# EAGLE design MC70_FSK_Modboard (EAGLE 6.4)
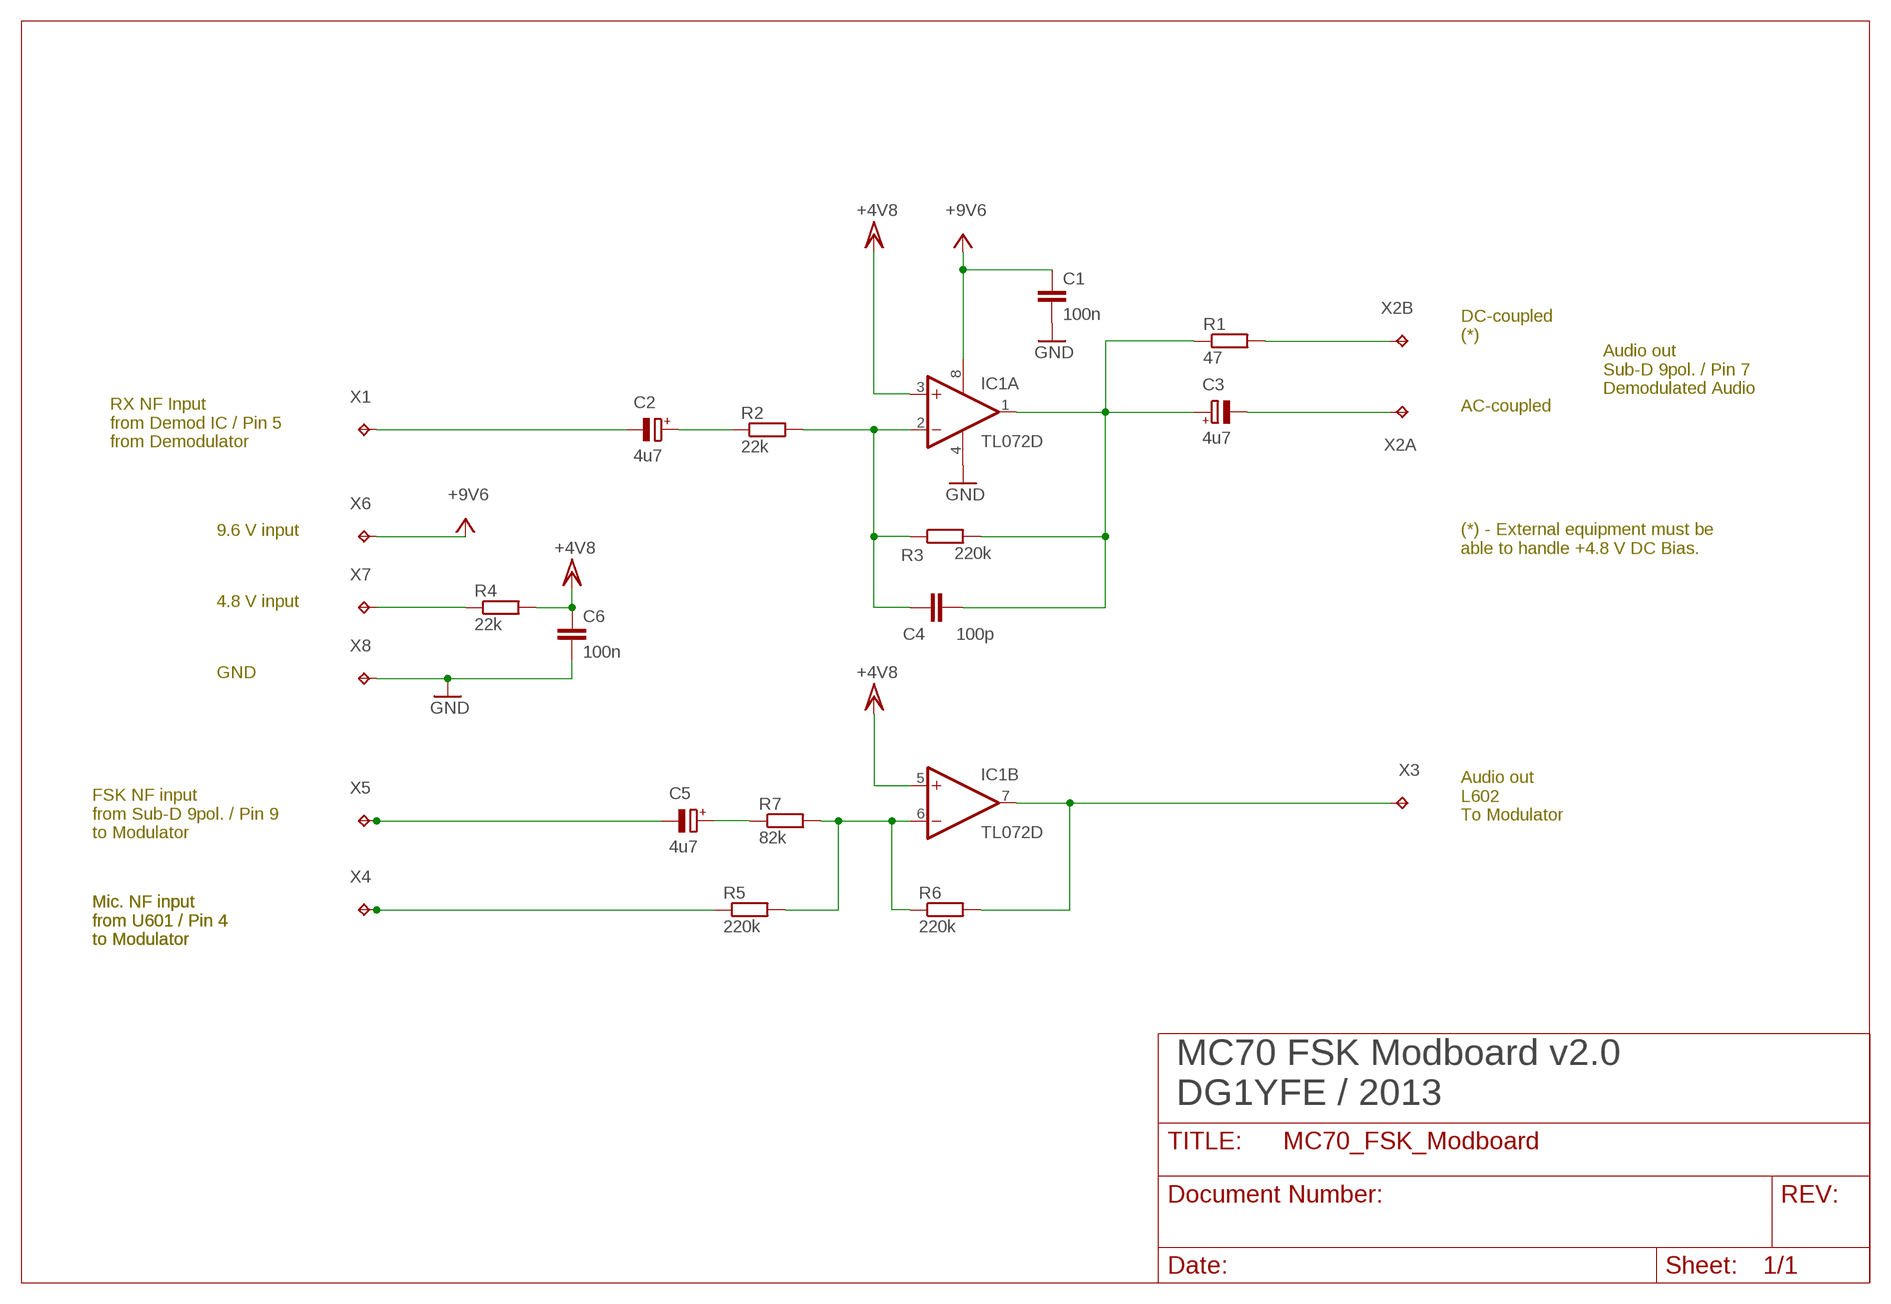
[diagram p0: schematic, sheet 1]

## Parts
C1  100n  C-EUC0805  [C0805]
C2  4u7  CPOL-EUA/3216-18R  [A/3216-18R]
C3  4u7  CPOL-EUA/3216-18R  [A/3216-18R]
C4  100p  C-EUC0805  [C0805]
C5  4u7  CPOL-EUA/3216-18R  [A/3216-18R]
C6  100n  C-EUC0805  [C0805]
IC1  TL072D  [SO08]
R1  47  R-EU_R0805  [R0805]
R2  22k  R-EU_R0805  [R0805]
R3  220k  R-EU_R0805  [R0805]
R4  22k  R-EU_R0805  [R0805]
R5  220k  R-EU_R0805  [R0805]
R6  220k  R-EU_R0805  [R0805]
R7  82k  R-EU_R0805  [R0805]
X1  TPTP15R  [TP15R]
X2A  TPTP15R  [TP15R]
X2B  TPTP15R  [TP15R]
X3  TPTP15R  [TP15R]
X4  TPTP15R  [TP15R]
X5  TPTP15R  [TP15R]
X6  TPTP15R  [TP15R]
X7  TPTP15R  [TP15R]
X8  TPTP15R  [TP15R]

## Nets
GND: C1.2 C6.2 IC1.4(P:V-) X8.TP
N$1: IC1.7(B:OUT) R6.2 X3.TP
N$2: R5.1 X4.TP
N$3: IC1.6(B:-IN) R5.2 R6.1 R7.2
N$4: C5.+ R7.1
N$5: C5.- X5.TP
N$6: C2.- X1.TP
N$7: C2.+ R2.1
N$8: R4.1 X7.TP
N$9: C4.2 IC1.2(A:-IN) R2.2 R3.1
N$11: C3.+ C4.1 IC1.1(A:OUT) R1.1 R3.2
N$12: C3.- X2A.TP
N$13: R1.2 X2B.TP
VCC: C1.1 IC1.8(P:V+) X6.TP ; supply symbol labelled +9V6
VCC/2: C6.1 IC1.3(A:+IN) IC1.5(B:+IN) R4.2 ; supply symbol labelled +4V8

## Notes on the sheet
- DC-coupled
  (*)
- Audio out
  Sub-D 9pol. / Pin 7
  Demodulated Audio
- AC-coupled
- RX NF Input
  from Demod IC / Pin 5
  from Demodulator
- 9.6 V input
- (*) - External equipment must be
  able to handle +4.8 V DC Bias.
- 4.8 V input
- GND
- Audio out
  L602
  To Modulator
- FSK NF input
  from Sub-D 9pol. / Pin 9
  to Modulator
- Mic. NF input
  from U601 / Pin 4
  to Modulator
- Mic. NF input
  from U601 / Pin 4
  to Modulator
- MC70 FSK Modboard v2.0
  DG1YFE / 2013

## Library data of the parts
C1 C4 C6 = rcl:C-EU: CAPACITOR, European symbol
C2 C3 C5 = rcl:CPOL-EU: POLARIZED CAPACITOR, European symbol
IC1 = linear:TL072: OP AMP
R1-R7 = rcl:R-EU_: RESISTOR, European symbol
X1 X2A X2B X3-X8 = testpad:TP: Test pad

## Board
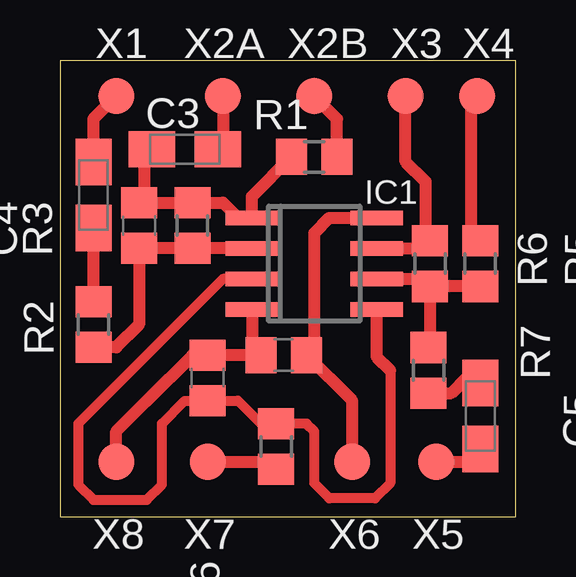
[diagram p1: board, top side]

Size 19 x 19 mm. Coordinates in mm from the lower left corner, seen from the top.
Outline: 0,0 19,0 19,19 0,19 0,0
Copper layers (1*16): Top 0.035mm / dielectric 1.5mm / Bottom 0.035mm
Design rules "standard *": minimum track width 0.15mm, minimum drill 0.3mm, track to track 0.15mm, track to pad 0.15mm, pad to pad 0.15mm, via to via 0.15mm, smd to smd 0.15mm, copper to edge 40mil, drill to drill 8mil, minimum pad ring 10mil, minimum via ring 8mil, stop-mask expansion 4mil, vias tented up to drill 0mil, thermal gap 10mil

### Footprints (pad centres in the part's own frame; a part is rotated, then mirrored left to right if it is on the bottom)
C0805 = smd 1.3 x 1.5: 1 -0.95,0; 2 0.95,0
A/3216-18R = smd 1.95 x 1.5: + 1.375,0; - -1.375,0
SO08 = smd 0.6 x 2.2: 1 -1.905,-2.6; 2 -0.635,-2.6; 3 0.635,-2.6; 4 1.905,-2.6; 5 1.905,2.6; 6 0.635,2.6; 7 -0.635,2.6; 8 -1.905,2.6
R0805 = smd 1.3 x 1.5: 1 -0.95,0; 2 0.95,0
TP15R = smd 1.5 x 1.5: TP 0,0

### Placement (x,y rotation side)
C1  9.33,6.73 180 top
C2  1.4,13.4 270 top
C3  5.21,15.3 180 top
C4  3.3,12.13 270 top
C5  17.53,4.19 90 top
C6  6.16,5.78 90 top
IC1  10.6,10.54 270 top
R1  10.6,14.99 0 top
R2  1.4,8 270 top
R3  5.52,12.13 90 top
R4  9.02,2.92 90 top
R5  17.53,10.54 270 top
R6  15.43,10.54 90 top
R7  15.37,6.1 90 top
X1  2.35,17.53 0 top
X2A  6.79,17.53 0 top
X2B  10.6,17.53 0 top
X3  14.41,17.53 0 top
X4  17.4,17.53 0 top
X5  15.68,2.29 0 top
X6  12.19,2.29 0 top
X7  6.16,2.29 0 top
X8  2.35,2.29 0 top

### Tracks (layer width: path | path; a pad name or v marks a point on that pad's centre or on a via)
GND
  Top 0.5: IC1.4 8.01,7.11 C1.2 5.53,6.73 C6.2 5.52,6.73 3.62,4.83 2.35,3.56 X8.TP
N$1
  Top 0.5: X3.TP 14.41,14.8 15.24,13.97 15.24,11.94 R6.2 15.69,11.18 IC1.7
N$2
  Top 0.5: X4.TP 17.14,17.14 17.14,11.49 R5.1
N$3
  Top 0.5: IC1.6 15.05,9.91 R6.1 | R5.2 R6.1 | R6.1 15.43,7.24 R7.2
N$4
  Top 0.5: R7.1 16.32,5.15 16.96,5.78 17.38,5.78 C5.+
N$5
  Top 0.5: X5.TP 17.59,2.29 17.59,2.92 C5.-
N$6
  Top 0.5: C2.- 1.4,16.57 X1.TP
N$7
  Top 0.5: R2.1 C2.+
N$8
  Top 0.5: X7.TP 9.02,2.29 R4.1
N$9
  Top 0.5: IC1.2 R3.1 | R3.1 5.21,11.18 | R2.2 2.35,7.05 3.3,8 C4.2 R3.1
N$11
  Top 0.5: R1.1 8.01,13.34 IC1.1 7.43,12.45 6.8,13.08 R3.2 C4.1 3.51,13.29 3.51,15.2 3.62,15.3 C3.+
N$12
  Top 0.5: X2A.TP 6.79,15.2 C3.-
N$13
  Top 0.5: R1.2 11.55,16.57 X2B.TP
VCC
  Top 0.5: X6.TP 12.19,4.82 C1.1 10.28,7.05 10.6,7.37 10.6,11.81 11.24,12.45 IC1.8
VCC/2
  Top 0.406: 13.78,6.1 13.78,1.4 13.14,0.76 11.24,0.76 10.6,1.4 10.6,3.56 10.29,3.87 9.34,3.87 R4.2 8.38,3.87 7.42,4.83 C6.1 5.21,4.83 4.25,3.87 4.25,1.33 3.62,0.7 1.4,0.7 0.76,1.33 0.76,3.87 6.79,9.91 IC1.3
  Top 0.5: IC1.5 13.2,6.67 13.78,6.1